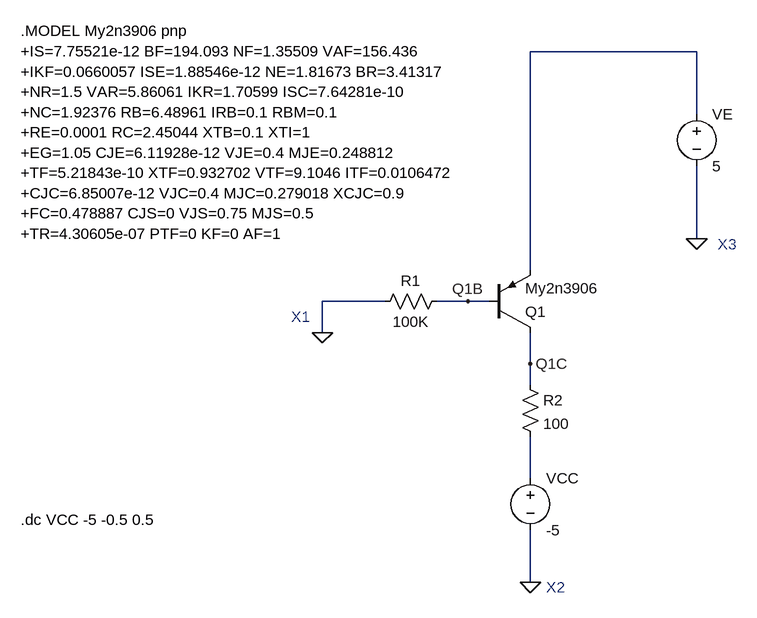
[diagram p0: schematic part2 schematic.asc]
part2 schematic.asc, the LTspice schematic file:
Version 4
SHEET 1 880 680
WIRE 608 -304 352 -304
WIRE 608 -208 608 -304
WIRE 608 -16 608 -128
WIRE 352 32 352 -304
WIRE 128 80 32 80
WIRE 256 80 208 80
WIRE 288 80 256 80
WIRE 32 128 32 80
WIRE 352 176 352 128
WIRE 352 208 352 176
WIRE 352 352 352 288
WIRE 352 512 352 432
FLAG 32 128 0
FLAG 352 512 0
FLAG 608 -16 0
FLAG 256 80 Q1B
FLAG 352 176 Q1C
SYMBOL res 224 64 R90
WINDOW 0 0 56 VBottom 2
WINDOW 3 32 56 VTop 2
SYMATTR InstName R1
SYMATTR Value 100K
SYMBOL voltage 352 336 R0
WINDOW 123 0 0 Left 0
WINDOW 39 0 0 Left 0
SYMATTR InstName VCC
SYMATTR Value -5
SYMBOL res 336 192 R0
SYMATTR InstName R2
SYMATTR Value 100
SYMBOL voltage 608 -224 R0
WINDOW 123 0 0 Left 0
WINDOW 39 0 0 Left 0
SYMATTR InstName VE
SYMATTR Value 5
SYMBOL pnp 288 128 M180
SYMATTR InstName Q1
SYMATTR Value My2n3906
TEXT 640 -8 Left 2 ;X3
TEXT 376 520 Left 2 ;X2
TEXT -16 104 Left 2 ;X1
TEXT -432 -336 Left 2 !.MODEL My2n3906 pnp\n+IS=7.75521e-12 BF=194.093 NF=1.35509 VAF=156.436\n+IKF=0.0660057 ISE=1.88546e-12 NE=1.81673 BR=3.41317\n+NR=1.5 VAR=5.86061 IKR=1.70599 ISC=7.64281e-10\n+NC=1.92376 RB=6.48961 IRB=0.1 RBM=0.1\n+RE=0.0001 RC=2.45044 XTB=0.1 XTI=1\n+EG=1.05 CJE=6.11928e-12 VJE=0.4 MJE=0.248812\n+TF=5.21843e-10 XTF=0.932702 VTF=9.1046 ITF=0.0106472\n+CJC=6.85007e-12 VJC=0.4 MJC=0.279018 XCJC=0.9\n+FC=0.478887 CJS=0 VJS=0.75 MJS=0.5\n+TR=4.30605e-07 PTF=0 KF=0 AF=1
TEXT -432 416 Left 2 !.dc VCC -5 -0.5 0.5

The netlist it stands for:
* part2 schematic.asc
R1 Q1B 0 100K
VCC N002 0 -5
R2 Q1C N002 100
VE N001 0 5
Q1 Q1C Q1B N001 0 My2n3906
.model NPN NPN
.model PNP PNP
.lib standard.bjt
* X3
* X2
* X1
.MODEL My2n3906 pnp
+IS=7.75521e-12 BF=194.093 NF=1.35509 VAF=156.436
+IKF=0.0660057 ISE=1.88546e-12 NE=1.81673 BR=3.41317
+NR=1.5 VAR=5.86061 IKR=1.70599 ISC=7.64281e-10
+NC=1.92376 RB=6.48961 IRB=0.1 RBM=0.1
+RE=0.0001 RC=2.45044 XTB=0.1 XTI=1
+EG=1.05 CJE=6.11928e-12 VJE=0.4 MJE=0.248812
+TF=5.21843e-10 XTF=0.932702 VTF=9.1046 ITF=0.0106472
+CJC=6.85007e-12 VJC=0.4 MJC=0.279018 XCJC=0.9
+FC=0.478887 CJS=0 VJS=0.75 MJS=0.5
+TR=4.30605e-07 PTF=0 KF=0 AF=1
.dc VCC -5 -0.5 0.5
.backanno
.end